# EAGLE design attiny85-ws2812b-v2 (EAGLE 9.0.0)
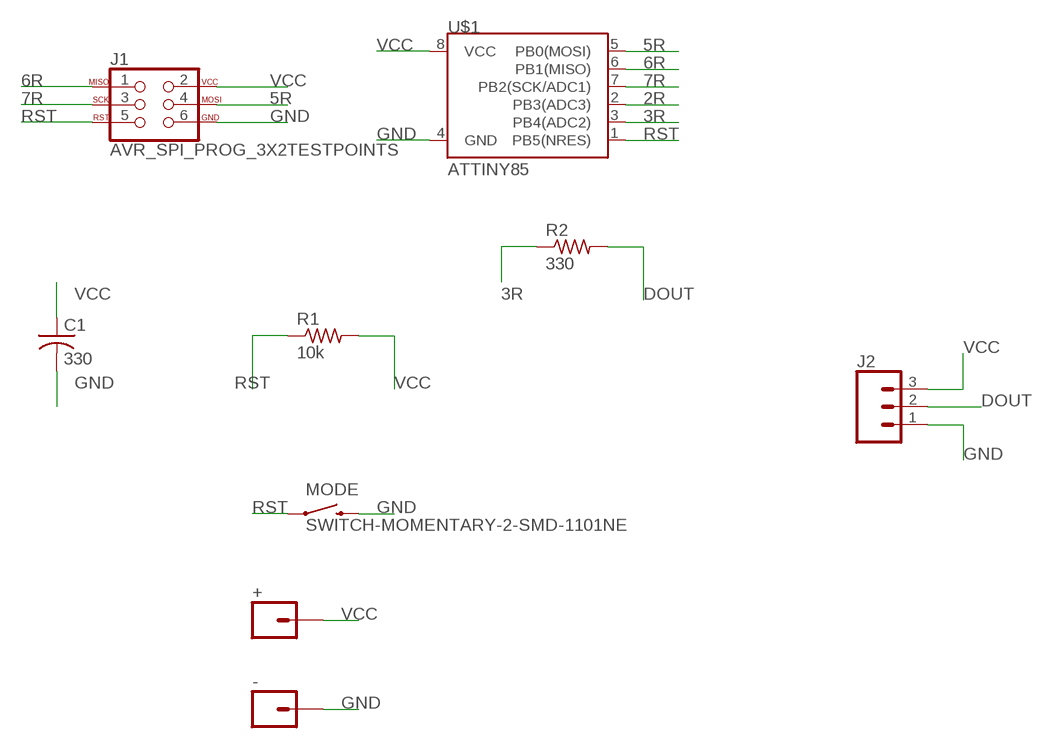
[diagram p0: schematic, sheet 1]

## Parts
+  CONN_01PTH_NO_SILK_YES_STOP  [1X01_NO_SILK]
-  CONN_01PTH_NO_SILK_YES_STOP  [1X01_NO_SILK]
C1  330  C-USC0603  [C0603]
J1  AVR_SPI_PROG_3X2TESTPOINTS  [2X3_TEST_POINTS]
J2  CONN_031X03_NO_SILK  [1X03_NO_SILK]
MODE  SWITCH-MOMENTARY-2-SMD-1101NE  [TACTILE-SWITCH-1101NE]
R1  10k  R-US_R0603  [R0603]
R2  330  R-US_R0603  [R0603]
U$1  ATTINY85  ATTINY45  [SO08-EIAJ]

## Nets
2R: U$1.2(PB3(ADC3))
3R: R2.1 U$1.3(PB4(ADC2))
5R: J1.4 U$1.5(PB0(MOSI))
6R: J1.1 U$1.6(PB1(MISO))
7R: J1.3 U$1.7(PB2(SCK/ADC1))
DOUT: J2.2 R2.2
GND: -.1 C1.2 J1.6 J2.1 MODE.P$2 U$1.4(GND)
RST: J1.5 MODE.P$1 R1.1 U$1.1(PB5(NRES))
VCC: +.1 C1.1 J1.2 J2.3 R1.2 U$1.8(VCC)

## Library data of the parts
+ - = SparkFun-Connectors:CONN_01: Single connection point. Often used as Generic Header-pin footprint for 0.1 inch spaced/style header connections On any of the 0.1 inch spaced packages, you can populate with these: Break Away Headers - Straight <https://www.sparkfun.com/products/116> (PRT-00116) Break Away Male Headers - Right Angle <https://www.sparkfun.com/products/553> (PRT-00553) Female Headers <https://www.sparkfun.com/products/115> (PRT-00115) Break Away Headers - Machine Pin <https://www.sparkfun.com/products/117> (PRT-00117) Break Away Female Headers - Swiss Machine Pin <https://www.sparkfun.com/products/743> (PRT-00743) This device is also useful as a general connection point to wire up your design to another part of your project. Our various solder wires solder well into these plated through hole pads. Hook-Up Wire - Assortment (Stranded, 22 AWG) <https://www.sparkfun.com/products/11375> (PRT-11375) Hook-Up Wire - Assortment (Solid Core, 22 AWG) <https://www.sparkfun.com/products/11367> (PRT-11367) View the entire wire category on our website here <https://www.sparkfun.com/categories/141> Special notes: SMTSO-256-ET is a "flush mount" nut for a 4-40 screw. We mostly use this on specialty testbeds; it is a nice way to connect hardware to your PCB at an adjustable hieght. Also note, the SNAP packages are for using a snappable style connector. We sell a baggie of snaps and they are also used on two LilyPad designs: Snap Assortment - 30 pack (male and female) <https://www.sparkfun.com/products/11347> (DEV-11347) LilyPad Arduino SimpleSnap <https://www.sparkfun.com/products/10941> (DEV-10941) LilyPad SimpleSnap Protoboard <https://www.sparkfun.com/products/10940> (DEV-10940)
C1 = adafruit:C-US: CAPACITOR, American symbol
J1 = SparkFun-Connectors:AVR_SPI_PROG_3X2: AVR ISP 6 Pin This is the reduced ISP connector for AVR programming. Common on Arduino. This footprint will take up less PCB space and can be used with a 10-pin to 6-pin adapter such as SKU: BOB-08508 **Special note about "TEST_POINT" package. The stop mask is on the top side, so if you want your programming test points to be on the bottom of your board, make sure to place this package on the bottom side of the board. This also ensure that the orientation to program from the bottom side will be correct. SparkFun Products: SparkFun ISP Pogo Adapter <https://www.sparkfun.com/products/11591> - NS Tiny AVR Programmer <https://www.sparkfun.com/products/11801> -PTH
J2 = SparkFun-Connectors:CONN_03: Multi connection point. Often used as Generic Header-pin footprint for 0.1 inch spaced/style header connections On any of the 0.1 inch spaced packages, you can populate with these: Break Away Headers - Straight <https://www.sparkfun.com/products/116> (PRT-00116) Break Away Male Headers - Right Angle <https://www.sparkfun.com/products/553> (PRT-00553) Female Headers <https://www.sparkfun.com/products/115> (PRT-00115) Break Away Headers - Machine Pin <https://www.sparkfun.com/products/117> (PRT-00117) Break Away Female Headers - Swiss Machine Pin <https://www.sparkfun.com/products/743> (PRT-00743) Stackable Header - 3 Pin (Female, 0.1") <https://www.sparkfun.com/products/13875> (PRT-13875) For SCREWTERMINALS and SPRING TERMINALS visit here: Screw Terimnals on SparkFun.com <https://www.sparkfun.com/search/results?term=Screw+Terminals> (5mm/3.5mm/2.54mm spacing) This device is also useful as a general connection point to wire up your design to another part of your project. Our various solder wires solder well into these plated through hole pads. Hook-Up Wire - Assortment (Stranded, 22 AWG) <https://www.sparkfun.com/products/11375> (PRT-11375) Hook-Up Wire - Assortment (Solid Core, 22 AWG) <https://www.sparkfun.com/products/11367> (PRT-11367) View the entire wire category on our website here <https://www.sparkfun.com/categories/141> Special notes: Molex polarized connector foot print use with SKU : PRT-08232 with associated crimp pins and housings.
MODE = SparkFun-Electromechanical:SWITCH-MOMENTARY-2: Various NO switches- pushbuttons, reed, etc
R1 = resistor:R-US_: RESISTOR, American symbol
R2 = adafruit:R-US_: RESISTOR, American symbol
U$1 = SparkFun:ATTINY45: Atmel ATTiny45

## Board
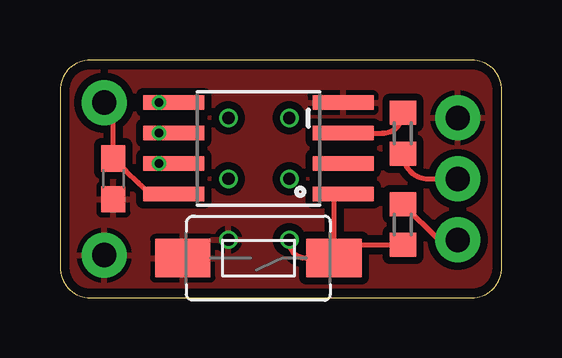
[diagram p1: board, top side]
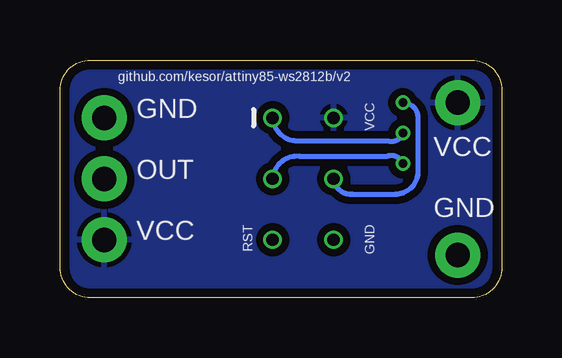
[diagram p2: board, bottom side, seen from below]

Size 18.41 x 9.91 mm. Coordinates in mm from the lower left corner, seen from the top.
Outline: 18.41,1.27 18.41,8.64 arc90 17.14,9.91 1.27,9.91 arc90 0,8.64 0,1.27 arc90 1.27,0 17.14,0 arc90 18.41,1.27
Copper layers (1*16): Top 0.035559375mm / dielectric 1.6mm / Bottom 0.035559375mm
Design rules "oshpark-2layer *": minimum track width 6mil, minimum drill 10mil, track to track 6mil, track to pad 6mil, pad to pad 6mil, via to via 6mil, smd to smd 0mil, copper to edge 15mil, drill to drill 6mil, minimum pad ring 5mil, minimum via ring 5mil, stop-mask expansion 5mil, vias tented up to drill 0mil, thermal gap 8mil

### Footprints (pad centres in the part's own frame; a part is rotated, then mirrored left to right if it is on the bottom)
1X01_NO_SILK = drill 1.016 pad 1.88: 1 0,0
C0603 = smd 1.1 x 1: 1 -0.85,0; 2 0.85,0
2X3_TEST_POINTS = drill 0.508: 1 -2.54,-1.27; 2 -2.54,1.27; 3 0,-1.27; 4 0,1.27; 5 2.54,-1.27; 6 2.54,1.27
1X03_NO_SILK = drill 1.016 pad 1.88: 1 0,0; 2 2.54,0; 3 5.08,0
TACTILE-SWITCH-1101NE = smd 2.3 x 1.6: P$1 -3.15,0; P$2 3.15,0
R0603 = smd 1 x 1.1: 1 -0.85,0; 2 0.85,0
SO08-EIAJ = smd 0.61 x 2.54: 1 -1.905,-3.543; 2 -0.635,-3.543; 3 0.635,-3.543; 4 1.905,-3.543; 5 1.905,3.518; 6 0.635,3.518; 7 -0.635,3.518; 8 -1.905,3.518

### Placement (x,y rotation side)
+  1.84,8.13 270 top
-  1.84,1.78 270 top
C1  2.22,4.95 270 top
J1  8.29,4.95 270 bottom
J2  16.57,7.49 270 top
MODE  8.27,1.65 180 top
R1  14.29,3.05 90 top
R2  14.29,6.86 270 top
U$1  8.26,6.22 90 top

### Tracks (layer width: path | path; a pad name or v marks a point on that pad's centre or on a via)
3R
  Top 0.203: U$1.3 13.44,6.86 arc90 R2.1
5R  (via drill 0.35)
  Top 0.203: U$1.5 v4.13,8.13
  Bottom 0.203: J1.4 arc-90 6.22,4.32 4.45,4.32 arc-90 3.49,5.27 3.49,7.49 arc-90 v4.13,8.13
6R  (via drill 0.35)
  Top 0.203: v4.13,6.86 U$1.6
  Bottom 0.203: J1.1 arc-90 8.45,6.54 4.76,6.54 arc-90 v4.13,6.86
7R  (via drill 0.35)
  Top 0.203: U$1.7 v4.13,5.59
  Bottom 0.203: J1.3 arc90 8.45,5.91 4.76,5.91 arc90 v4.13,5.59
DOUT
  Top 0.203: R2.2 arc90 15.34,4.95 J2.2
GND
  pour Top (isolate 0.305, rank 6): 1.27,9.91 17.14,9.91 arc-90 18.41,8.64 18.41,1.27 arc-90 17.14,0 1.27,0 arc-90 0,1.27 0,8.64 arc-90
RST
  Top 0.203: MODE.P$1 11.42,3.94 arc-90 U$1.1 | MODE.P$1 10.16,1.65 arc-90 J1.5 | MODE.P$1 arc-90 11.96,2.2 R1.1
VCC
  Top 0.203: U$1.8 3.81,4.32 | 3.81,4.32 3.71,4.32 | R1.2 15.77,2.41 J2.3 | 3.81,4.32 arc-4 C1.1 2.22,7.75 +.1
  pour Bottom (isolate 0.305, rank 6): 1.27,9.91 17.14,9.91 arc-90 18.41,8.64 18.41,1.27 arc-90 17.14,0 1.27,0 arc-90 0,1.27 0,8.64 arc-90

### Text on the board
bPlace: github.com/kesor/attiny85-ws2812b/v2
bNames: VCC | GND | VCC | OUT | GND | GND | RST | VCC